# Altium schematic sheet 3_Fibre.SCHDOC
size 297 x 209 mm; SheetNumber: 9; SheetTotal: 18; DocumentName: 3_Fibre.SCHDOC
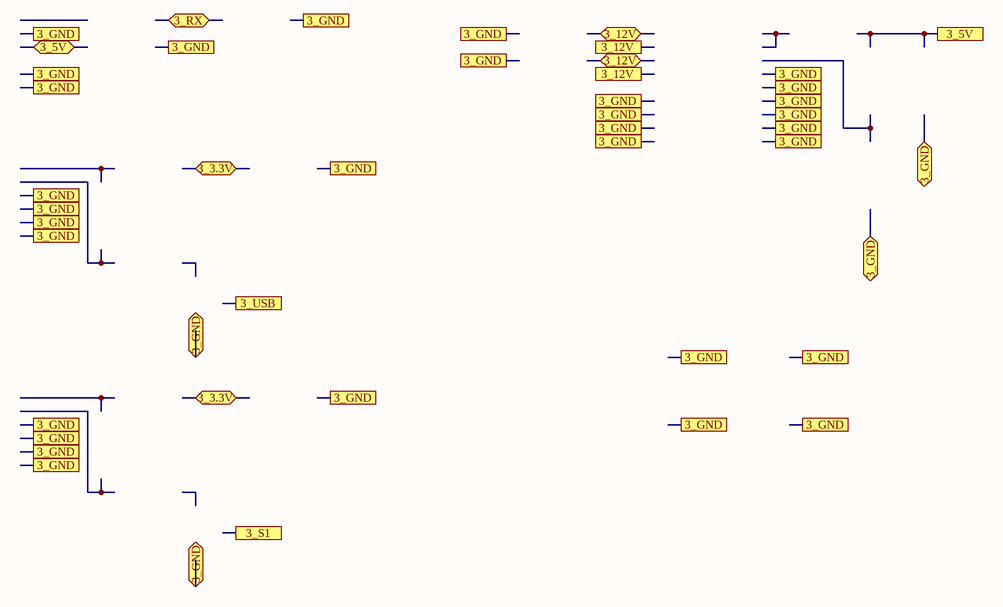
[diagram p0: 3_Fibre.SCHDOC]

## Ports
3_3.3V (bidir), 3_5V, 3_5V (bidir), 3_12V, 3_12V (bidir), 3_GND, 3_RX (bidir), 3_S1, 3_USB

## Notes on the sheet
- A
- B
- C
- D
- 1
- 2
- 3
- Title
- 4
- Size
- A4
- Number
- Rev
- Date
- Filename
- Drawn by
- Sheet
- of